# Altium project inwall_wifi_psu.PrjPcb
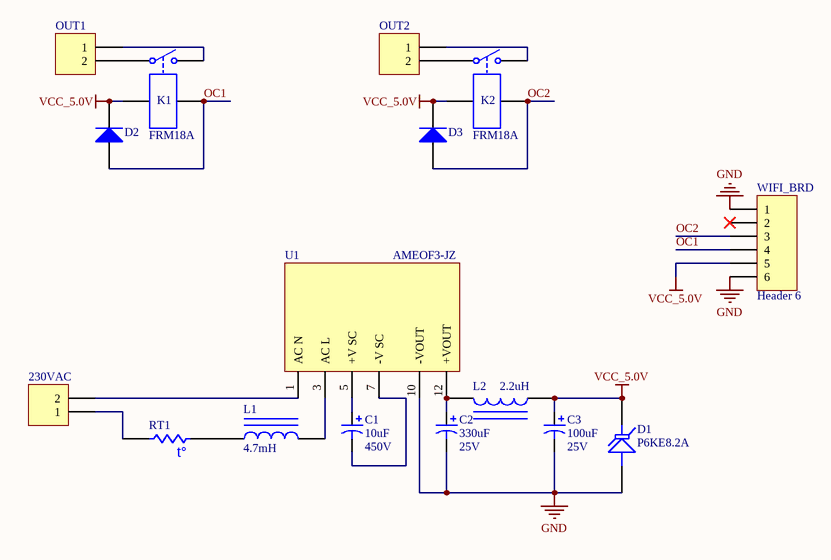
[diagram p0: inwall_wifi_psu.SchDoc]
1 sheet, 16 parts. Net scope: global (net labels, ports and power ports of the same name join across sheets).
Board file: inwall_wifi_psu.PcbDoc

## Sheet inwall_wifi_psu.SchDoc
size A4

### Parts
230VAC  Header 2  [DG126-5.0-2P14]  (value not drawn)
C1  value 10uF  Voltage: 450V  [Capacitor Polarised 10x20x5mm]  (hidden comment: UCY2W100MPD)
C2  value 330uF  Voltage: 25V  [Capacitor Polarised 10x12.5x5mm]  (hidden comment: UVZ1E331MPD)
C3  value 100uF  Voltage: 25V  [Capacitor Polarised 6.3x11x2.5mm]  (hidden comment: UVZ1E101MED)
D1  P6KE8.2A  [Vertically mounted diode 3x6.3mm]
D2  Diode 1N4148  [DO-35]  (value not drawn)
D3  Diode 1N4148  [DO-35]  (value not drawn)
K1  FRM18A  [FRM18A]
K2  FRM18A  [FRM18A]
L1  value 4.7mH  [Inductor 11.5x11.5x5mm]  (hidden comment: COIL0912-4.7)
L2  value 2.2uH  [Axial Inductor 3x8mm vertically]  (hidden comment: DLA2.2-N)
OUT1  Header 2  [DG126-5.0-2P14]  (value not drawn)
OUT2  Header 2  [DG126-5.0-2P14]  (value not drawn)
RT1  EPCOS B57236S500M  [NTC 11.5x6mm]  (value not drawn)
U1  AMEOF3-JZ  [AMEOF3-JZ]
WIFI_BRD  Header 6  [HDR1X6]

### Nets
GND: C2.2 C3.2 D1.1(A) U1.10(-VOUT) WIFI_BRD.1 WIFI_BRD.6
VCC_5.0V: C3.1 D1.2(K) D2.2(K) D3.2(K) K1.3 K2.3 L2.1 WIFI_BRD.5
OC1: D2.1(A) K1.4 WIFI_BRD.4
OC2: D3.1(A) K2.4 WIFI_BRD.3
Net230VAC_1: 230VAC.1 RT1.2
Net230VAC_2: 230VAC.2 U1.1(AC_N)
NetC1_1: C1.1 U1.5(+V_SC)
NetC1_2: C1.2 U1.7(-V_SC)
NetC2_1: C2.1 L2.2 U1.12(+VOUT)
NetK1_1: K1.1 OUT1.2
NetK1_2: K1.2 OUT1.1
NetK2_1: K2.1 OUT2.2
NetK2_2: K2.2 OUT2.1
NetL1_1: L1.1 RT1.1
NetL1_2: L1.2 U1.3(AC_L)

Not connected (* = marked no-connect by the designer): WIFI_BRD 2*

### Notes on the sheet
- (in symbol Res Thermal) t°

### Library data of the parts
230VAC OUT1 OUT2 = Header 2: Header, 2-Pin; LatestRevisionDate: 17-Jul-2002; LatestRevisionNote: Re-released for DXP Platform.; Publisher: Altium Limited
C1-C3 = Cap Pol1: Polarized Capacitor (Radial); Published: 8-Jun-2000; LatestRevisionDate: 17-Jul-2002; LatestRevisionNote: Re-released for DXP Platform.; PackageReference: RB7.6-15; Publisher: Altium Limited; PackageDescription: Polarized Capacitor (Radial); 2 Leads; Supplier 1: TME
  C1: Supplier Part Number 1: UCY2W100MPD
  C2: Supplier Part Number 1: UVZ1E331MPD
  C3: Supplier Part Number 1: UVZ1E101MED
D1 = Tranzorb: Transient Voltage Suppression (TVS) Diode; Published: 24-Mar-1999; LatestRevisionDate: 17-Jul-2002; LatestRevisionNote: Re-released for DXP Platform.; PackageReference: DO-7; Publisher: Altium Limited; PackageDescription: Axial Lead Diode; Supplier 1: TME; Supplier Part Number 1: P6KE8.2A-DIO
D2 D3 = Diode 1N4148: High Conductance Fast Diode; Published: 8-Jun-2000; LatestRevisionDate: 17-Jul-2002; LatestRevisionNote: Re-released for DXP Platform.; DatasheetVersion: 1997; PackageReference: DO-35; Publisher: Altium Limited; PackageDescription: Diode, Axial; Body 3.8 x 1.9 mm (LxDia. max), Lead Dia. 0.53 mm (max); Code_JEDEC: DO-204-AH; ComponentLink1Description: Manufacturer Link; ComponentLink1URL: http://www.fairchildsemi.com/; ComponentLink2Description: Datasheet; ComponentLink2URL: http://www.fairchildsemi.com/ds/1N%2F1N4148.pdf
K1 K2 = Relay-SPST: Single-Pole Single-Throw Relay; Published: 24-Mar-1999; LatestRevisionDate: 17-Jul-2002; LatestRevisionNote: Re-released for DXP Platform.; PackageReference: MODULE4; Publisher: Altium Limited; Supplier 1: TME; Supplier Part Number 1: FRM18A-5VDC
L1 L2 = Inductor Iron: Magnetic-Core Inductor; Published: 24-Mar-1999; LatestRevisionDate: 17-Jul-2002; LatestRevisionNote: Re-released for DXP Platform.; PackageReference: AXIAL-0.9; Publisher: Altium Limited; PackageDescription: Axial Device, Thru-Hole; 2 Leads; 0.9 in Pin Spacing; Supplier 1: TME
  L1: Supplier Part Number 1: COIL1010-4.7; Supplier 2: TME; Supplier Part Number 2: COIL0912-4.7
  L2: Supplier Part Number 1: DLA2.2-N
RT1 = Res Thermal: Thermistor; Published: 24-Mar-1999; LatestRevisionDate: 29-May-2009; LatestRevisionNote: IPC-7351 Footprint Added.; PackageVersion: Mar-2003; PackageReference: 6-0805; Publisher: Altium Limited; PackageDescription: Chip Resistor 0805 Case Size; Code_IPC: RESC2012; Supplier 1: TME; Supplier Part Number 1: B57236S500M
U1 = AMEOF3-JZ: 230AC / 3W DC switching PSU; Supplier 1: TME; Supplier Part Number 1: AMEOF3-5SJZ
WIFI_BRD = Header 6: Header, 6-Pin; LatestRevisionDate: 17-Jul-2002; LatestRevisionNote: Re-released for DXP Platform.; Publisher: Altium Limited